# EAGLE design ramanSpectrometer_electronic_controlBoard (EAGLE 6.2)
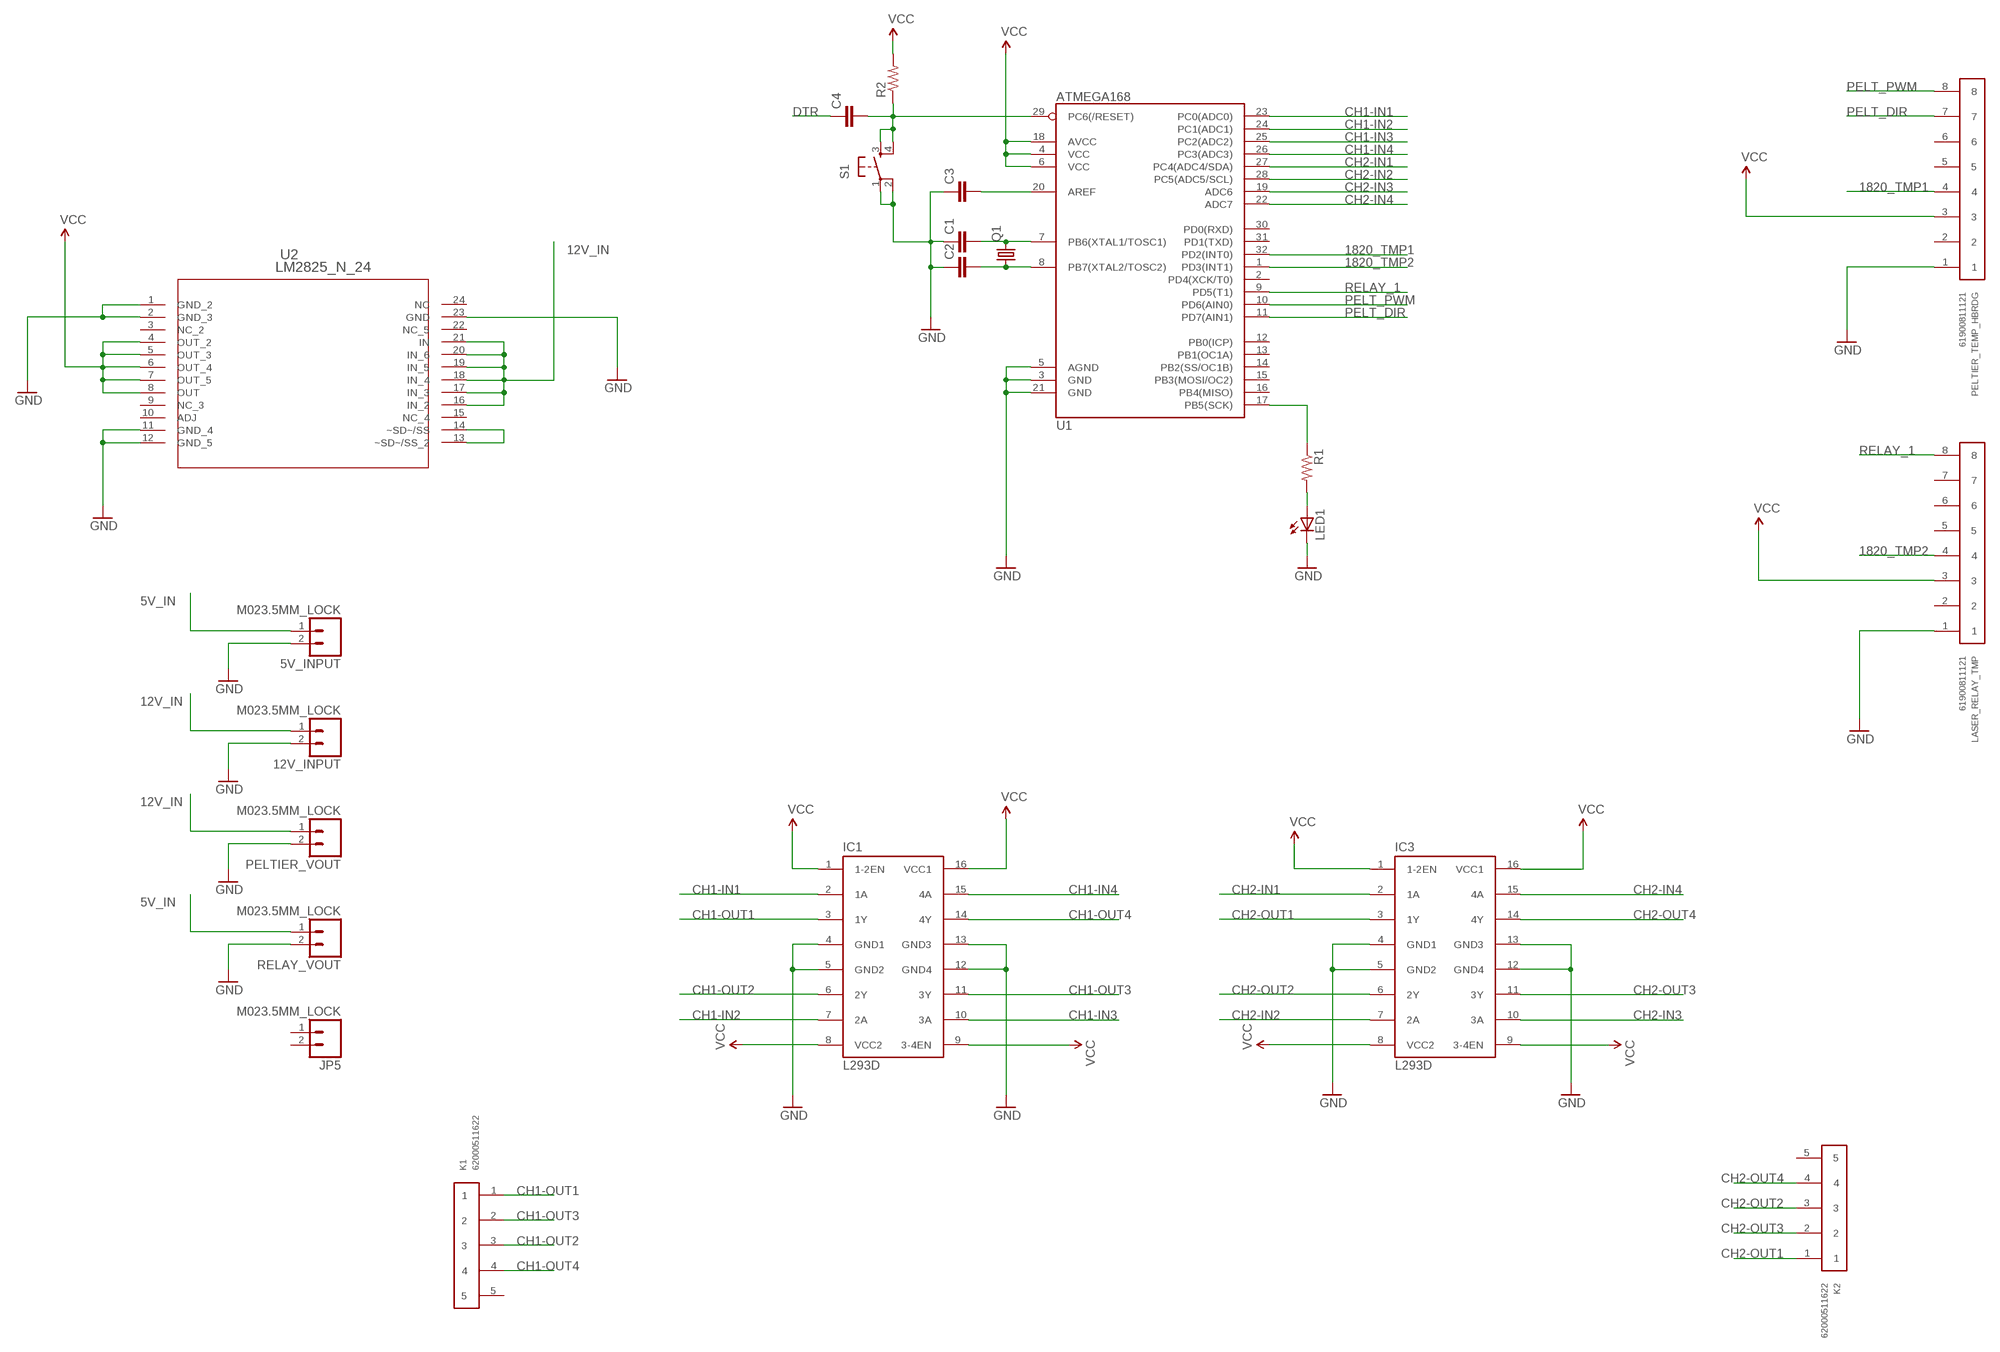
[diagram p0: schematic, sheet 1]

## Parts
5V_INPUT  M023.5MM_LOCK  [SCREWTERMINAL-3.5MM-2_LOCK]
12V_INPUT  M023.5MM_LOCK  [SCREWTERMINAL-3.5MM-2_LOCK]
C1  CAP1206  [1206]
C2  CAP1206  [1206]
C3  CAP1210  [1210]
C4  CAP1210  [1210]
IC1  L293D  [DIL16]
IC3  L293D  [DIL16]
JP5  M023.5MM_LOCK  [SCREWTERMINAL-3.5MM-2_LOCK]
K1  62000511622  [62000511622]
K2  62000511622  [62000511622]
LASER_RELAY_TMP  61900811121  [61900811121]
LED1  LEDP-LCC-2  [P-LCC-2]
PELTIER_TEMP_HBRDG  61900811121  [61900811121]
PELTIER_VOUT  M023.5MM_LOCK  [SCREWTERMINAL-3.5MM-2_LOCK]
Q1  CRYSTALSM49  [SM49]
R1  RESISTOR1206  [1206]
R2  RESISTOR1206  [1206]
RELAY_VOUT  M023.5MM_LOCK  [SCREWTERMINAL-3.5MM-2_LOCK]
S1  TAC_SWITCHSMD  [TACTILE_SWITCH_SMD]
U1  ATMEGA168  [TQFP32-08]
U2  LM2825_N_24  [NA24F]

## Nets
5V_IN: 5V_INPUT.1 RELAY_VOUT.1
12V_IN: 12V_INPUT.1 PELTIER_VOUT.1 U2.16(IN_2) U2.17(IN_3) U2.18(IN_4) U2.19(IN_5) U2.20(IN_6) U2.21(IN)
1820_TMP1: PELTIER_TEMP_HBRDG.4 U1.32(PD2(INT0))
1820_TMP2: LASER_RELAY_TMP.4 U1.1(PD3(INT1))
CH1-IN1: IC1.2(1A) U1.23(PC0(ADC0))
CH1-IN2: IC1.7(2A) U1.24(PC1(ADC1))
CH1-IN3: IC1.10(3A) U1.25(PC2(ADC2))
CH1-IN4: IC1.15(4A) U1.26(PC3(ADC3))
CH1-OUT1: IC1.3(1Y) K1.1
CH1-OUT2: IC1.6(2Y) K1.3
CH1-OUT3: IC1.11(3Y) K1.2
CH1-OUT4: IC1.14(4Y) K1.4
CH2-IN1: IC3.2(1A) U1.27(PC4(ADC4/SDA))
CH2-IN2: IC3.7(2A) U1.28(PC5(ADC5/SCL))
CH2-IN3: IC3.10(3A) U1.19(ADC6)
CH2-IN4: IC3.15(4A) U1.22(ADC7)
CH2-OUT1: IC3.3(1Y) K2.1
CH2-OUT2: IC3.6(2Y) K2.3
CH2-OUT3: IC3.11(3Y) K2.2
CH2-OUT4: IC3.14(4Y) K2.4
DTR: C4.1
GND: 5V_INPUT.2 12V_INPUT.2 C1.1 C2.1 C3.1 IC1.4(GND1) IC1.5(GND2) IC1.12(GND4) IC1.13(GND3) IC3.4(GND1) IC3.5(GND2) IC3.12(GND4) IC3.13(GND3) LASER_RELAY_TMP.1 LED1.C PELTIER_TEMP_HBRDG.1 PELTIER_VOUT.2 RELAY_VOUT.2 S1.1 S1.2 U1.3(GND) U1.5(AGND) U1.21(GND) U2.1(GND_2) U2.2(GND_3) U2.11(GND_4) U2.12(GND_5) U2.23(GND)
N$1: LED1.A R1.2
N$2: R1.1 U1.17(PB5(SCK))
N$3: C1.2 Q1.2 U1.7(PB6(XTAL1/TOSC1))
N$4: C3.2 U1.20(AREF)
N$5: C2.2 Q1.1 U1.8(PB7(XTAL2/TOSC2))
N$8: C4.2 R2.1 S1.3 S1.4 U1.29(PC6(/RESET))
N$10: U2.13(~SD~/SS_2) U2.14(~SD~/SS)
PELT_DIR: PELTIER_TEMP_HBRDG.7 U1.11(PD7(AIN1))
PELT_PWM: PELTIER_TEMP_HBRDG.8 U1.10(PD6(AIN0))
RELAY_1: LASER_RELAY_TMP.8 U1.9(PD5(T1))
VCC: IC1.1(1-2EN) IC1.8(VCC2) IC1.9(3-4EN) IC1.16(VCC1) IC3.1(1-2EN) IC3.8(VCC2) IC3.9(3-4EN) IC3.16(VCC1) LASER_RELAY_TMP.3 PELTIER_TEMP_HBRDG.3 R2.2 U1.4(VCC) U1.6(VCC) U1.18(AVCC) U2.4(OUT_2) U2.5(OUT_3) U2.6(OUT_4) U2.7(OUT_5) U2.8(OUT)
Unconnected: JP5.1 JP5.2 K1.5 K2.5 LASER_RELAY_TMP.2 LASER_RELAY_TMP.5 LASER_RELAY_TMP.6 LASER_RELAY_TMP.7 PELTIER_TEMP_HBRDG.2 PELTIER_TEMP_HBRDG.5 PELTIER_TEMP_HBRDG.6 U1.2(PD4(XCK/T0)) U1.12(PB0(ICP)) U1.13(PB1(OC1A)) U1.14(PB2(SS/OC1B)) U1.15(PB3(MOSI/OC2)) U1.16(PB4(MISO)) U1.30(PD0(RXD)) U1.31(PD1(TXD)) U2.3(NC_2) U2.9(NC_3) U2.10(ADJ) U2.15(NC_4) U2.22(NC_5) U2.24(NC)

## Library data of the parts
5V_INPUT 12V_INPUT JP5 PELTIER_VOUT RELAY_VOUT = SparkFun-Connectors:M02: Standard 2-pin 0.1" header. Use with - straight break away headers ( PRT-00116) - right angle break away headers (PRT-00553) - swiss pins (PRT-00743) - machine pins (PRT-00117) - female headers (PRT-00115) Molex polarized connector foot print use with: PRT-08233 with associated crimp pins and housings. 2.54_SCREWTERM for use with PRT-10571. 3.5mm Screw Terminal footprints for PRT-08084 5mm Screw Terminal footprints for use with PRT-08433
C1-C4 = SparkFun-Capacitors:CAP: Capacitor Standard 0603 ceramic capacitor, and 0.1" leaded capacitor.
IC1 IC3 = st-microelectronics:L293D: PUSH-PULL 4 CHANNEL DRIVER; MPN: L293D; OC_FARNELL: 9589619; OC_NEWARK: 56P8249
K1 K2 = Wuerth_Elektronik_eiCan_Wire_to_Board_Connectors:62000511622: WR-WTB 2.00mm Male Vertical Shrouded Header, 5 Pins
LASER_RELAY_TMP PELTIER_TEMP_HBRDG = Wuerth_Elektronik_eiCan_Wire_to_Board_Connectors:61900811121: WR-WTB 2.54mm Male Locking Header, 8 Pins
LED1 = adafruit:LED: LED OSRAM: - CHIPLED LG R971, LG N971, LY N971, LG Q971, LY Q971, LO R971, LY R971 LH N974, LH R974 LS Q976, LO Q976, LY Q976 LO Q996 - Hyper CHIPLED LW Q18S LB Q993, LB Q99A, LB R99A - SideLED LS A670, LO A670, LY A670, LG A670, LP A670 LB A673, LV A673, LT A673, LW A673 LH A674 LY A675 LS A676, LA A676, LO A676, LY A676, LW A676 LS A679, LY A679, LG A679 - Hyper Micro SIDELED® LS Y876, LA Y876, LO Y876, LY Y876 LT Y87S - SmartLED LW L88C, LW L88S LB L89C, LB L89S, LG L890 LS L89K, LO L89K, LY L89K LS L896, LA L896, LO L896, LY L896 - TOPLED LS T670, LO T670, LY T670, LG T670, LP T670 LSG T670, LSP T670, LSY T670, LOP T670, LYG T670 LG T671, LOG T671, LSG T671 LB T673, LV T673, LT T673, LW T673 LH T674 LS T676, LA T676, LO T676, LY T676, LB T676, LH T676, LSB T676, LW T676 LB T67C, LV T67C, LT T67C, LS T67K, LO T67K, LY T67K, LW E67C LS E67B, LA E67B, LO E67B, LY E67B, LB E67C, LV E67C, LT E67C LW T67C LS T679, LY T679, LG T679 LS T770, LO T770, LY T770, LG T770, LP T770 LB T773, LV T773, LT T773, LW T773 LH T774 LS E675, LA E675, LY E675, LS T675 LS T776, LA T776, LO T776, LY T776, LB T776 LHGB T686 LT T68C, LB T68C - Hyper Mini TOPLED® LB M676 - Mini TOPLED Santana® LG M470 LS M47K, LO M47K, LY M47K Source: http://www.osram.convergy.de/
Q1 = adafruit:CRYSTAL: CRYSTAL; OC_FARNELL: unknown; OC_NEWARK: unknown
R1 R2 = SparkFun-Passives:RESISTOR: Resistor Basic schematic elements and footprints for 0603, 1206, and PTH resistors.
S1 = SparkFun-Electromechanical:TAC_SWITCH: Momentary Switch Button commonly used for reset or general input. Spark Fun Electronics SKU : COM-00097 SMT- SWCH-08247; PROD_ID: SWCH-08247
U1 = SparkFun-DigitalIC:ATMEGA168: Atmel 32-pin 8-bit micro, 16k flash.
U2 = lm2825:LM2825_N_24; BASE_PN: LM2825; COMPTYPE: Switcher; PARTNUMBER: LM2825HN-ADJ; SYMBOL: NameLM2825HN-ADJ; TYPE: LM2825HN-ADJ; VENDOR: NationalSemiconductor; VERSION: 05/02/2007

## Board
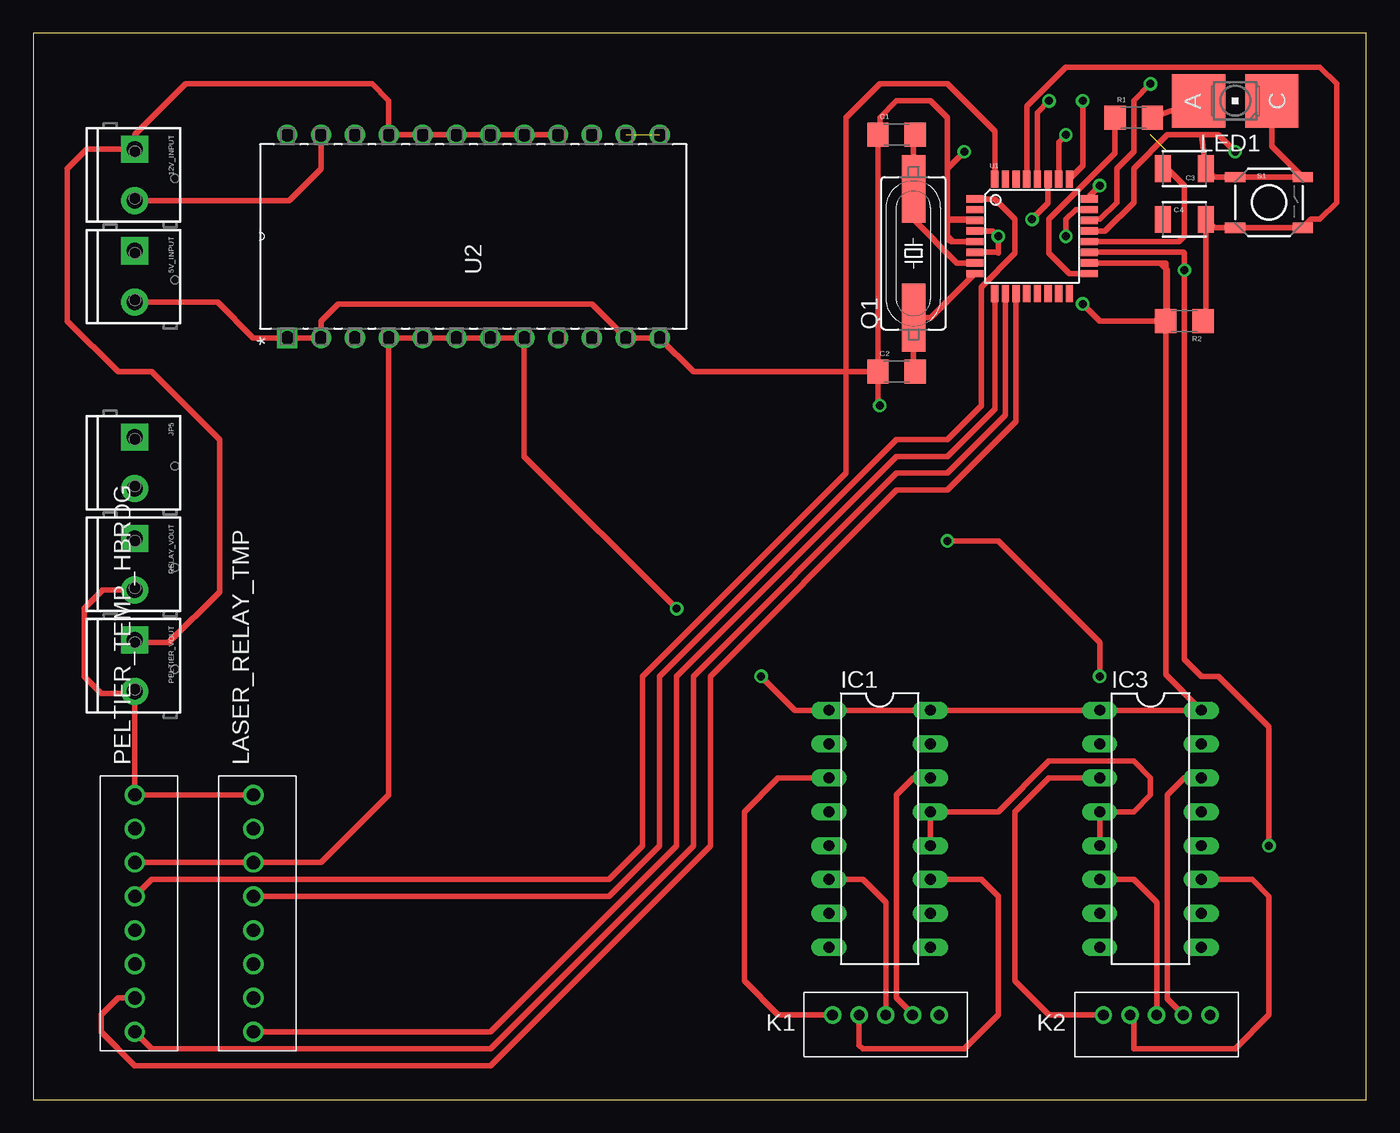
[diagram p1: board, top side]
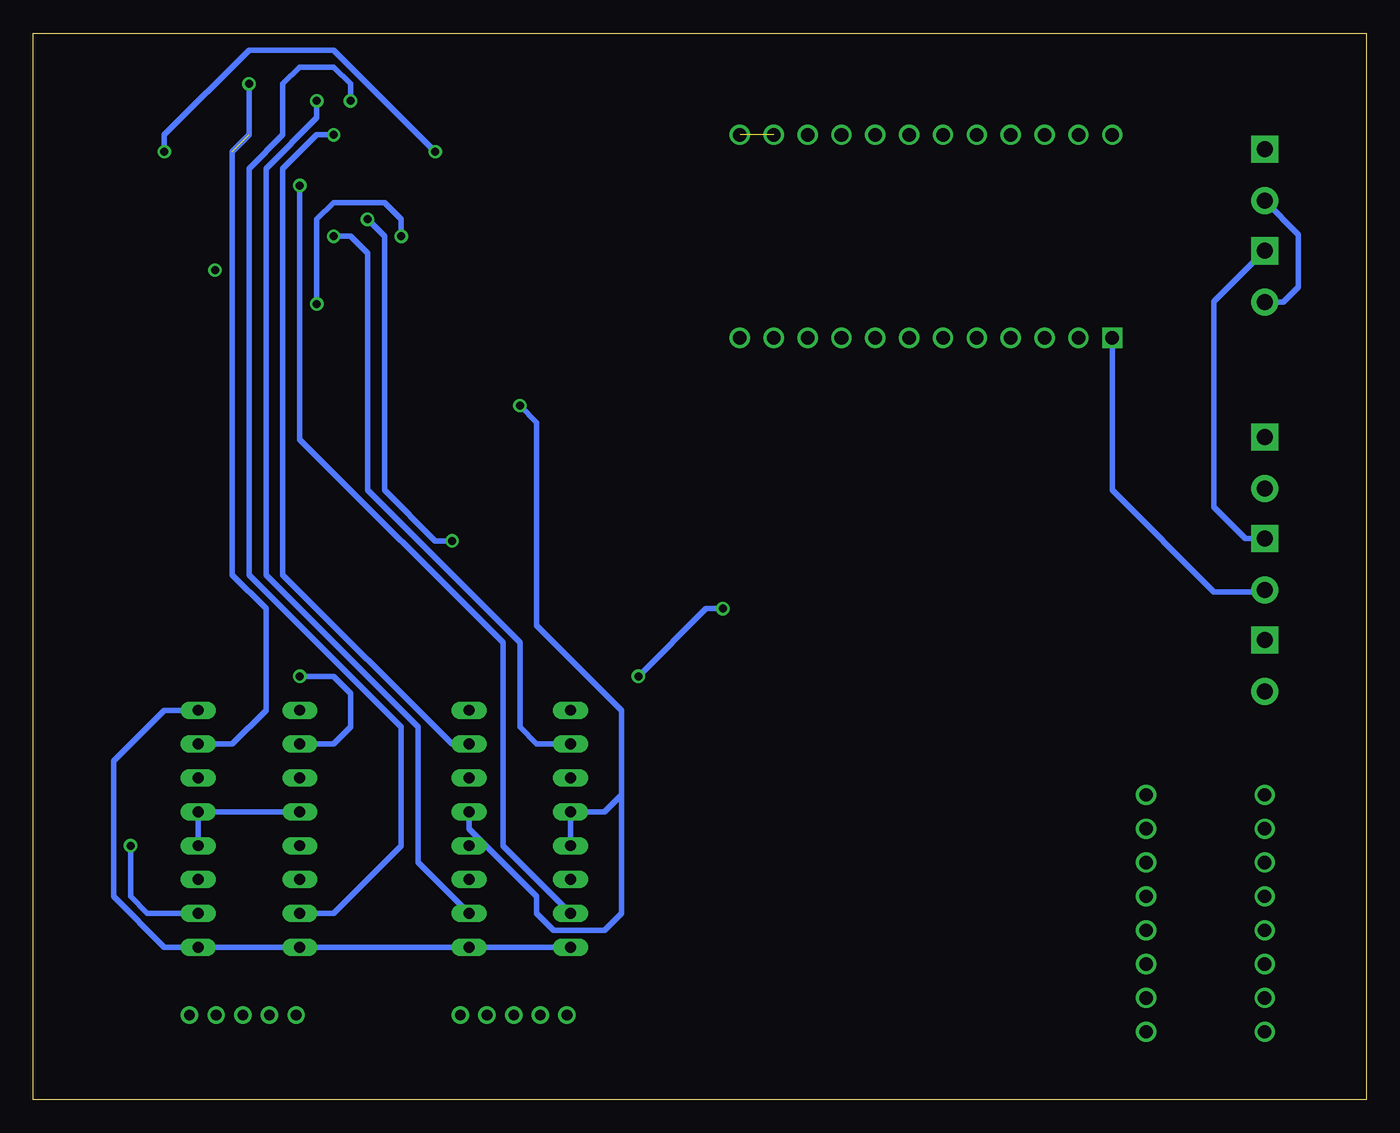
[diagram p2: board, bottom side, seen from below]

Size 100 x 80 mm. Coordinates in mm from the lower left corner, seen from the top.
Outline: 0,0 100,0 100,80 0,80 0,0
Copper layers (1*16): Top 0.035mm / dielectric 1.5mm / Bottom 0.035mm
Design rules: minimum track width 10mil, minimum drill 24mil, track to track 8mil, track to pad 8mil, pad to pad 8mil, via to via 8mil, smd to smd 8mil, copper to edge 40mil, drill to drill 8mil, minimum pad ring 10mil, minimum via ring 8mil, stop-mask expansion 4mil, vias tented up to drill 0mil, thermal gap 10mil

### Footprints (pad centres in the part's own frame; a part is rotated, then mirrored left to right if it is on the bottom)
SCREWTERMINAL-3.5MM-2_LOCK = drill 1.2 pad 2.032 square: 1 -0.178,0 | drill 1.2 pad 2.032: 2 3.678,0
1206 = smd 1.6 x 1.8: 1 -1.4,0; 2 1.4,0
1210 = smd 1.2 x 2: 1 -1.6,0; 2 1.6,0
DIL16 = drill 0.813 long: 1 -8.89,-3.81; 2 -6.35,-3.81; 3 -3.81,-3.81; 4 -1.27,-3.81; 5 1.27,-3.81; 6 3.81,-3.81; 7 6.35,-3.81; 8 8.89,-3.81; 9 8.89,3.81; 10 6.35,3.81; 11 3.81,3.81; 12 1.27,3.81; 13 -1.27,3.81; 14 -3.81,3.81; 15 -6.35,3.81; 16 -8.89,3.81
62000511622 = drill 0.8: 1 1,0; 2 -1,0; 3 -3,0; 4 -5,0; 5 -7,0
61900811121 = drill 1: 1 1.27,0; 2 -1.27,0; 3 -3.81,0; 4 -6.35,0; 5 -8.89,0; 6 -11.43,0; 7 -13.97,0; 8 -16.51,0
P-LCC-2 = smd 4 x 4: A 0,2.75; C 0,-2.75
SM49 = smd 5.08 x 1.778: 1 -4.826,0; 2 4.826,0
TACTILE_SWITCH_SMD = smd 1.524 x 0.762: 1 -2.54,1.905; 2 2.54,1.905; 3 -2.54,-1.905; 4 2.54,-1.905
TQFP32-08 = smd 1.27 x 0.559: 1 -4.293,2.8; 2 -4.293,2; 3 -4.293,1.2; 4 -4.293,0.4; 5 -4.293,-0.4; 6 -4.293,-1.2; 7 -4.293,-2; 8 -4.293,-2.8; 17 4.293,-2.8; 18 4.293,-2; 19 4.293,-1.2; 20 4.293,-0.4; 21 4.293,0.4; 22 4.293,1.2; 23 4.293,2; 24 4.293,2.8 | smd 0.559 x 1.27: 9 -2.8,-4.293; 10 -2,-4.293; 11 -1.2,-4.293; 12 -0.4,-4.293; 13 0.4,-4.293; 14 1.2,-4.293; 15 2,-4.293; 16 2.8,-4.293; 25 2.8,4.293; 26 2,4.293; 27 1.2,4.293; 28 0.4,4.293; 29 -0.4,4.293; 30 -1.2,4.293; 31 -2,4.293; 32 -2.8,4.293
NA24F = drill 1.016 square: 1 -15.24,27.94 | drill 1.016: 2 -15.24,25.4; 3 -15.24,22.86; 4 -15.24,20.32; 5 -15.24,17.78; 6 -15.24,15.24; 7 -15.24,12.7; 8 -15.24,10.16; 9 -15.24,7.62; 10 -15.24,5.08; 11 -15.24,2.54; 12 -15.24,0; 13 0,0; 14 0,2.54; 15 0,5.08; 16 0,7.62; 17 0,10.16; 18 0,12.7; 19 0,15.24; 20 0,17.78; 21 0,20.32; 22 0,22.86; 23 0,25.4; 24 0,27.94

### Placement (x,y rotation side)
5V_INPUT  7.62,63.5 270 top
12V_INPUT  7.62,71.12 270 top
C1  64.77,72.39 0 top
C2  64.77,54.61 0 top
C3  86.36,69.85 180 top
C4  86.36,66.04 0 top
IC1  63.5,20.32 270 top
IC3  83.82,20.32 270 top
JP5  7.62,49.53 270 top
K1  60.96,6.35 180 top
K2  81.28,6.35 180 top
LASER_RELAY_TMP  16.51,21.59 90 top
LED1  90.17,74.93 90 top
PELTIER_TEMP_HBRDG  7.62,21.59 90 top
PELTIER_VOUT  7.62,34.29 270 top
Q1  66.04,63.5 90 top
R1  82.55,73.66 0 top
R2  86.36,58.42 180 top
RELAY_VOUT  7.62,41.91 270 top
S1  92.71,67.31 0 top
U1  74.93,64.77 0 top
U2  46.99,72.39 90 top

### Tracks (layer width: path | path; a pad name or v marks a point on that pad's centre or on a via)
5V_IN
  Bottom 0.406: 5V_INPUT.1 11.43,59.87 11.43,44.45 9.07,42.09 RELAY_VOUT.1
12V_IN
  Top 0.406: PELTIER_VOUT.1 7.8,34.29 10.16,34.29 13.97,38.1 13.97,49.53 8.89,54.61 6.35,54.61 2.54,58.42 2.54,69.85 3.99,71.3 12V_INPUT.1 7.62,72.39 11.43,76.2 25.4,76.2 26.67,74.93 U2.21 U2.20 U2.19 U2.18 U2.17 U2.16
1820_TMP1
  Top 0.406: PELTIER_TEMP_HBRDG.4 8.89,16.51 43.18,16.51 45.72,19.05 45.72,31.75 60.96,46.99 60.96,73.66 63.5,76.2 68.58,76.2 72.13,72.65 U1.32
1820_TMP2
  Top 0.406: LASER_RELAY_TMP.4 43.18,15.24 46.99,19.05 46.99,31.75 64.77,49.53 68.58,49.53 71.12,52.07 71.12,60.96 73.66,63.5 73.66,66.04 72.13,67.57 U1.1
CH1-IN1  (via drill 0.6)
  Top 0.406: v77.47,64.77 77.47,66.04 78.2,66.77 U1.23
  Bottom 0.406: IC1.2 62.23,26.67 63.5,27.94 63.5,34.29 74.93,45.72 74.93,63.5 76.2,64.77 v77.47,64.77
CH1-IN2  (via drill 0.6)
  Top 0.406: v80.01,68.58 79.22,67.79 U1.24
  Bottom 0.406: IC1.7 64.77,19.05 64.77,34.29 80.01,49.53 v80.01,68.58
CH1-IN3  (via drill 0.6)
  Top 0.406: U1.25 78.74,70.07 v78.74,74.93
  Bottom 0.406: IC1.10 71.12,17.78 71.12,27.94 82.55,39.37 82.55,69.85 78.74,73.66 v78.74,74.93
CH1-IN4  (via drill 0.6)
  Top 0.406: v77.47,72.39 76.93,71.85 U1.26
  Bottom 0.406: IC1.15 68.58,26.67 81.28,39.37 81.28,69.85 78.74,72.39 v77.47,72.39
CH1-OUT1
  Top 0.406: K1.1 55.88,6.35 53.34,8.89 53.34,21.59 55.88,24.13 IC1.3
CH1-OUT2
  Top 0.406: K1.3 63.96,14.78 62.23,16.51 IC1.6
CH1-OUT3
  Top 0.406: K1.2 61.96,4.08 62.23,3.81 69.85,3.81 72.39,6.35 72.39,15.24 71.12,16.51 IC1.11
CH1-OUT4
  Top 0.406: K1.4 65.96,6.43 64.77,7.62 64.77,22.86 66.04,24.13 IC1.14
CH2-IN1  (via drill 0.6)
  Top 0.406: U1.27 76.13,67.24 v74.93,66.04 | v68.58,41.91 72.39,41.91 80.01,34.29 v80.01,31.75
  Bottom 0.406: IC3.2 77.47,26.67 76.2,27.94 76.2,30.48 77.47,31.75 v80.01,31.75 | v74.93,66.04 73.66,64.77 73.66,45.72 69.85,41.91 v68.58,41.91
CH2-IN2  (via drill 0.6)
  Top 0.406: v76.2,74.93 75.33,74.06 U1.28
  Bottom 0.406: IC3.7 77.47,13.97 72.39,19.05 72.39,27.94 83.82,39.37 83.82,69.85 81.28,72.39 81.28,76.2 80.01,77.47 77.47,77.47 76.2,76.2 v76.2,74.93
CH2-IN3  (via drill 0.6)
  Top 0.406: U1.19 86.29,63.57 86.36,63.5 86.36,33.02 87.63,31.75 88.9,31.75 92.71,27.94 v92.71,19.05
  Bottom 0.406: IC3.10 91.44,13.97 92.71,15.24 v92.71,19.05
CH2-IN4  (via drill 0.6)  (3 unrouted)
  Top 0.406: U1.22 79.29,66.04 80.01,66.04 81.28,67.31 81.28,69.85 82.55,71.12 82.55,74.93 v83.82,76.2
  Bottom 0.406: IC3.15 85.09,26.67 82.55,29.21 82.55,36.83 85.09,39.37 85.09,71.12 83.82,72.39 v83.82,76.2
CH2-OUT1
  Top 0.406: K2.1 76.2,6.35 73.66,8.89 73.66,21.59 76.2,24.13 IC3.3
CH2-OUT2
  Top 0.406: K2.3 84.28,14.78 82.55,16.51 IC3.6
CH2-OUT3
  Top 0.406: K2.2 82.55,6.08 82.55,3.81 90.17,3.81 92.71,6.35 92.71,15.24 91.44,16.51 IC3.11
CH2-OUT4
  Top 0.406: K2.4 85.09,7.54 85.09,22.86 86.36,24.13 IC3.14
GND  (via drill 0.6)
  Top 0.406: C2.1 C1.1 63.5,72.52 63.5,73.66 64.77,74.93 67.31,74.93 68.58,73.66 68.58,69.85 | LASER_RELAY_TMP.1 PELTIER_TEMP_HBRDG.1 PELTIER_VOUT.2 7.49,30.48 5.08,30.48 3.81,31.75 3.81,36.83 5.21,38.23 RELAY_VOUT.2 | 68.58,66.04 68.65,65.97 U1.3 70.57,66.04 68.58,66.04 | 68.58,66.04 68.58,64.77 | 68.58,64.77 68.98,64.37 | LED1.C 92.92,71.55 S1.2 S1.1 88.59,69.22 C3.1 87.63,72.39 | 12V_INPUT.2 19.18,67.44 21.59,69.85 U2.23 | 5V_INPUT.2 13.84,59.82 16.51,57.15 U2.1 U2.2 21.59,58.42 22.86,59.69 41.91,59.69 U2.11 U2.12 49.53,54.61 C2.1 | C2.1 63.37,52.2 v63.5,52.07 | C2.1 63.5,54.61 | IC1.12 IC1.13 72.39,21.59 76.2,25.4 82.55,25.4 83.82,24.13 83.82,22.86 82.55,21.59 IC3.4 IC3.5 | U1.5 68.98,64.37 | 68.98,64.37 arc-90 68.58,64.77 | 68.58,66.04 68.58,69.85 | 68.58,69.85 v69.85,71.12 | U1.21 80.41,65.17 82.55,67.31 82.55,69.85 85.09,72.39 87.63,72.39 | 87.63,72.39 88.9,72.39 v90.17,71.12
  Bottom 0.406: RELAY_VOUT.2 7.62,38.1 11.43,38.1 19.05,45.72 U2.1 | IC1.5 IC1.4 57.15,21.59 55.88,22.86 | 55.88,22.86 55.88,29.21 62.23,35.56 62.23,50.8 v63.5,52.07 | IC3.4 IC3.13 IC3.12 | IC1.13 67.31,20.32 62.23,15.24 62.23,13.97 60.96,12.7 57.15,12.7 55.88,13.97 55.88,22.86 | 12V_INPUT.2 5.08,64.9 5.08,60.96 6.22,59.82 5V_INPUT.2 | v90.17,71.12 90.17,72.39 83.82,78.74 77.47,78.74 v69.85,71.12
N$1
  Top 0.406: LED1.A R1.2
N$2
  Top 0.406: R1.1 81.15,70.99 76.2,66.04 76.2,63.5 77.73,61.97 U1.17
N$3
  Top 0.406: U1.7 69.31,62.77 66.04,66.04 Q1.2 66.04,72.26 C1.2
N$4
  Top 0.406: C3.2 85.09,69.85 86.36,68.58 86.36,64.77 85.96,64.37 U1.20
N$5
  Top 0.406: U1.8 67.34,58.67 Q1.1 66.04,54.74 C2.2
N$6  (via drill 0.6)
  other vias: 86.36,62.23
N$8
  Top 0.406: R2.1 87.96,58.62 C4.2 88.59,65.41 S1.3 S1.4 95.89,66.04 96.52,66.04 97.79,67.31 97.79,76.2 96.52,77.47 77.47,77.47 74.53,74.53 U1.29
N$10  (1 unrouted)
PELT_DIR
  Top 0.406: PELTIER_TEMP_HBRDG.7 6.35,7.62 5.08,6.35 5.08,5.08 7.62,2.54 34.29,2.54 50.8,19.05 50.8,31.75 64.77,45.72 68.58,45.72 73.73,50.87 U1.11
PELT_PWM
  Top 0.406: PELTIER_TEMP_HBRDG.8 8.89,3.81 34.29,3.81 49.53,19.05 49.53,31.75 64.77,46.99 68.58,46.99 72.93,51.34 U1.10
RELAY_1
  Top 0.406: LASER_RELAY_TMP.8 34.29,5.08 48.26,19.05 48.26,31.75 64.77,48.26 68.58,48.26 72.13,51.81 U1.9
VCC  (via drill 0.6)
  Top 0.406: PELTIER_TEMP_HBRDG.3 LASER_RELAY_TMP.3 21.59,17.78 26.67,22.86 U2.4 U2.5 U2.6 U2.7 U2.8 36.83,48.26 v48.26,36.83 | U1.4 71.99,65.17 v72.39,64.77 72.39,63.5 72.32,63.57 U1.6 | v54.61,31.75 57.15,29.21 IC1.1 IC1.16 IC3.1 IC3.16 84.96,31.88 R2.2 84.96,62.77 U1.18 84.55,62.77 85.09,62.23 85.09,58.42 80.01,58.42 v78.74,59.69
  Bottom 0.406: v48.26,36.83 49.53,36.83 v54.61,31.75 | IC1.8 IC1.9 IC3.8 IC3.9 | 88.9,11.43 IC3.9 | IC3.9 90.17,11.43 93.98,15.24 93.98,25.4 90.17,29.21 IC3.16 | v78.74,59.69 78.74,66.04 77.47,67.31 73.66,67.31 72.39,66.04 v72.39,64.77